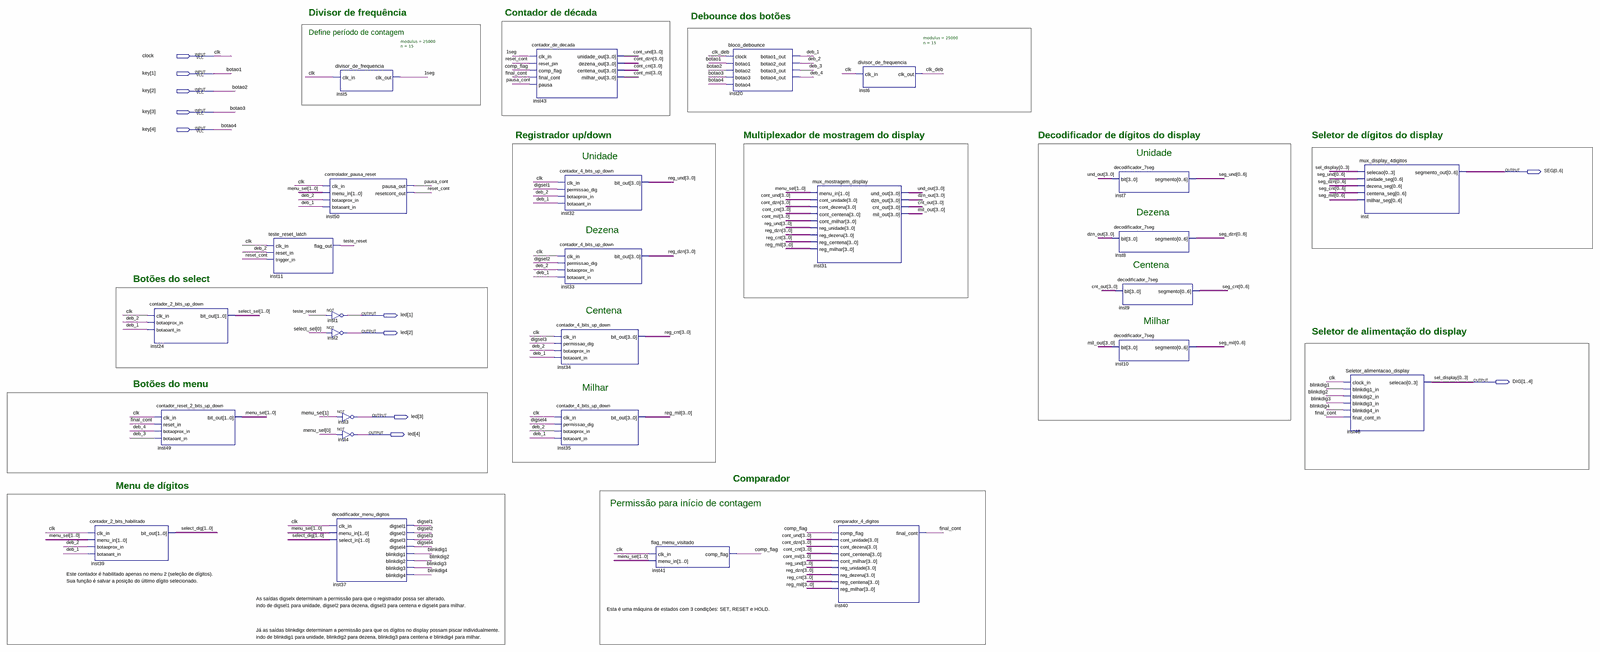
[diagram p0: schematic sheet, whole]
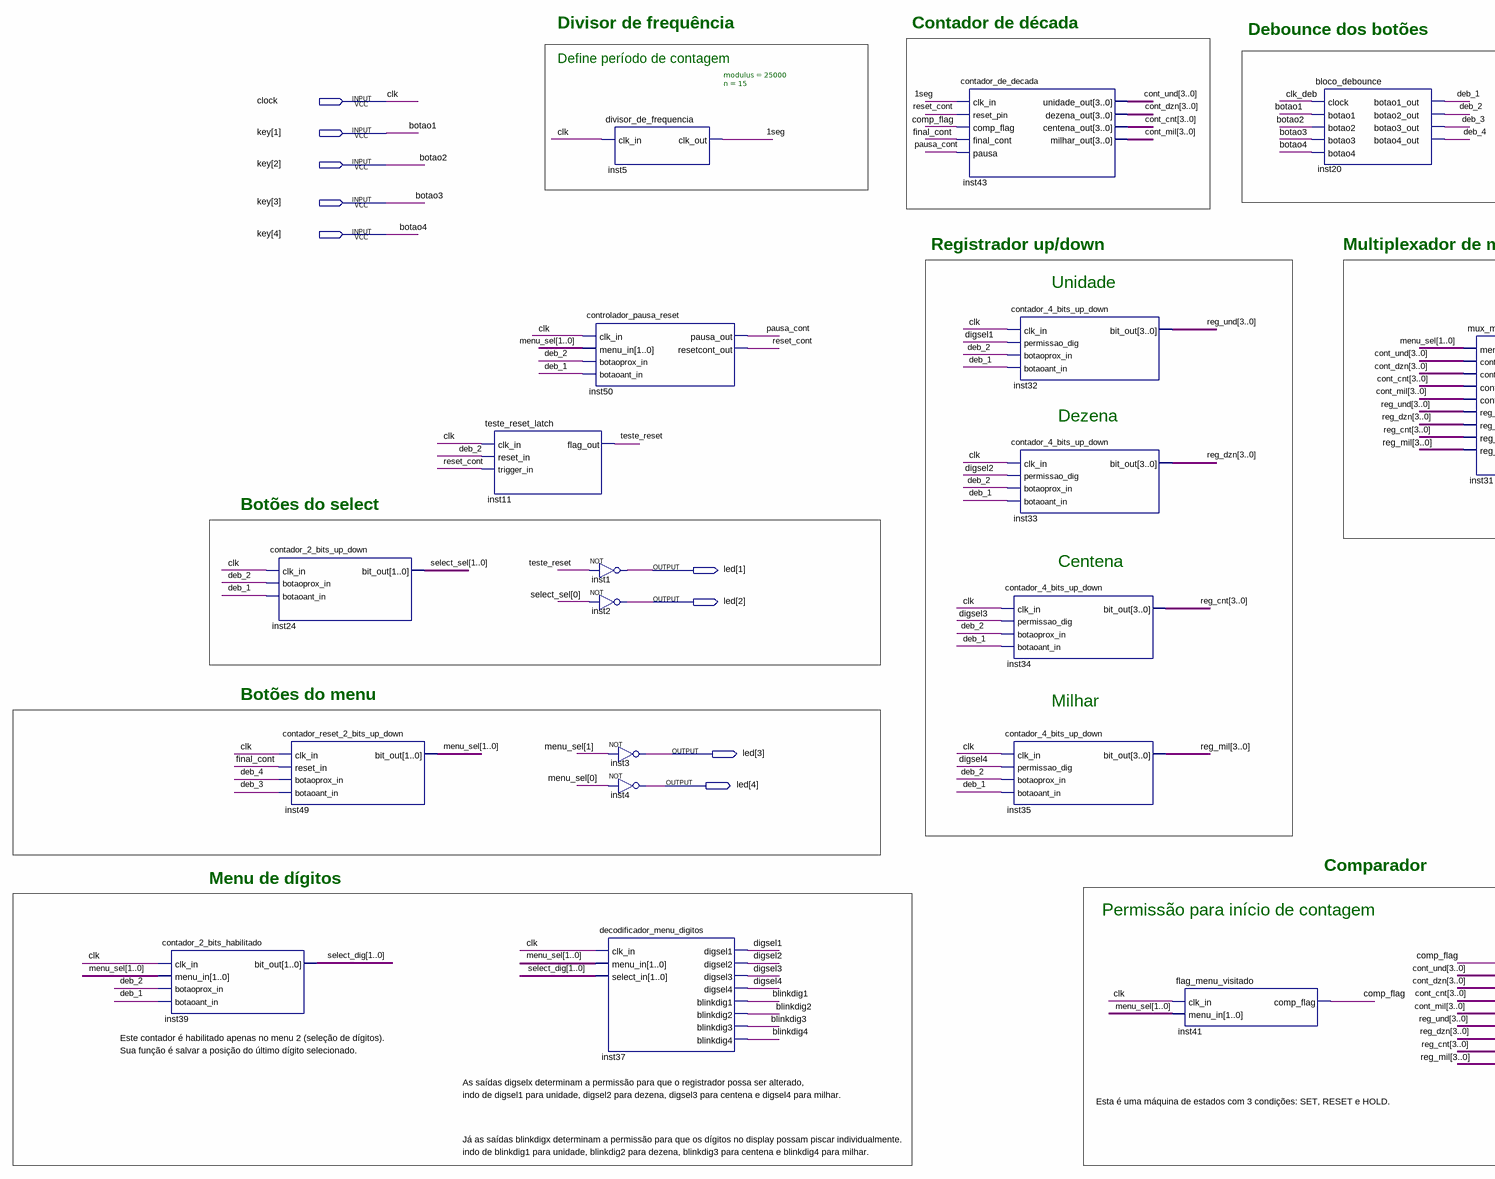
[diagram p1: schematic sheet, left part]
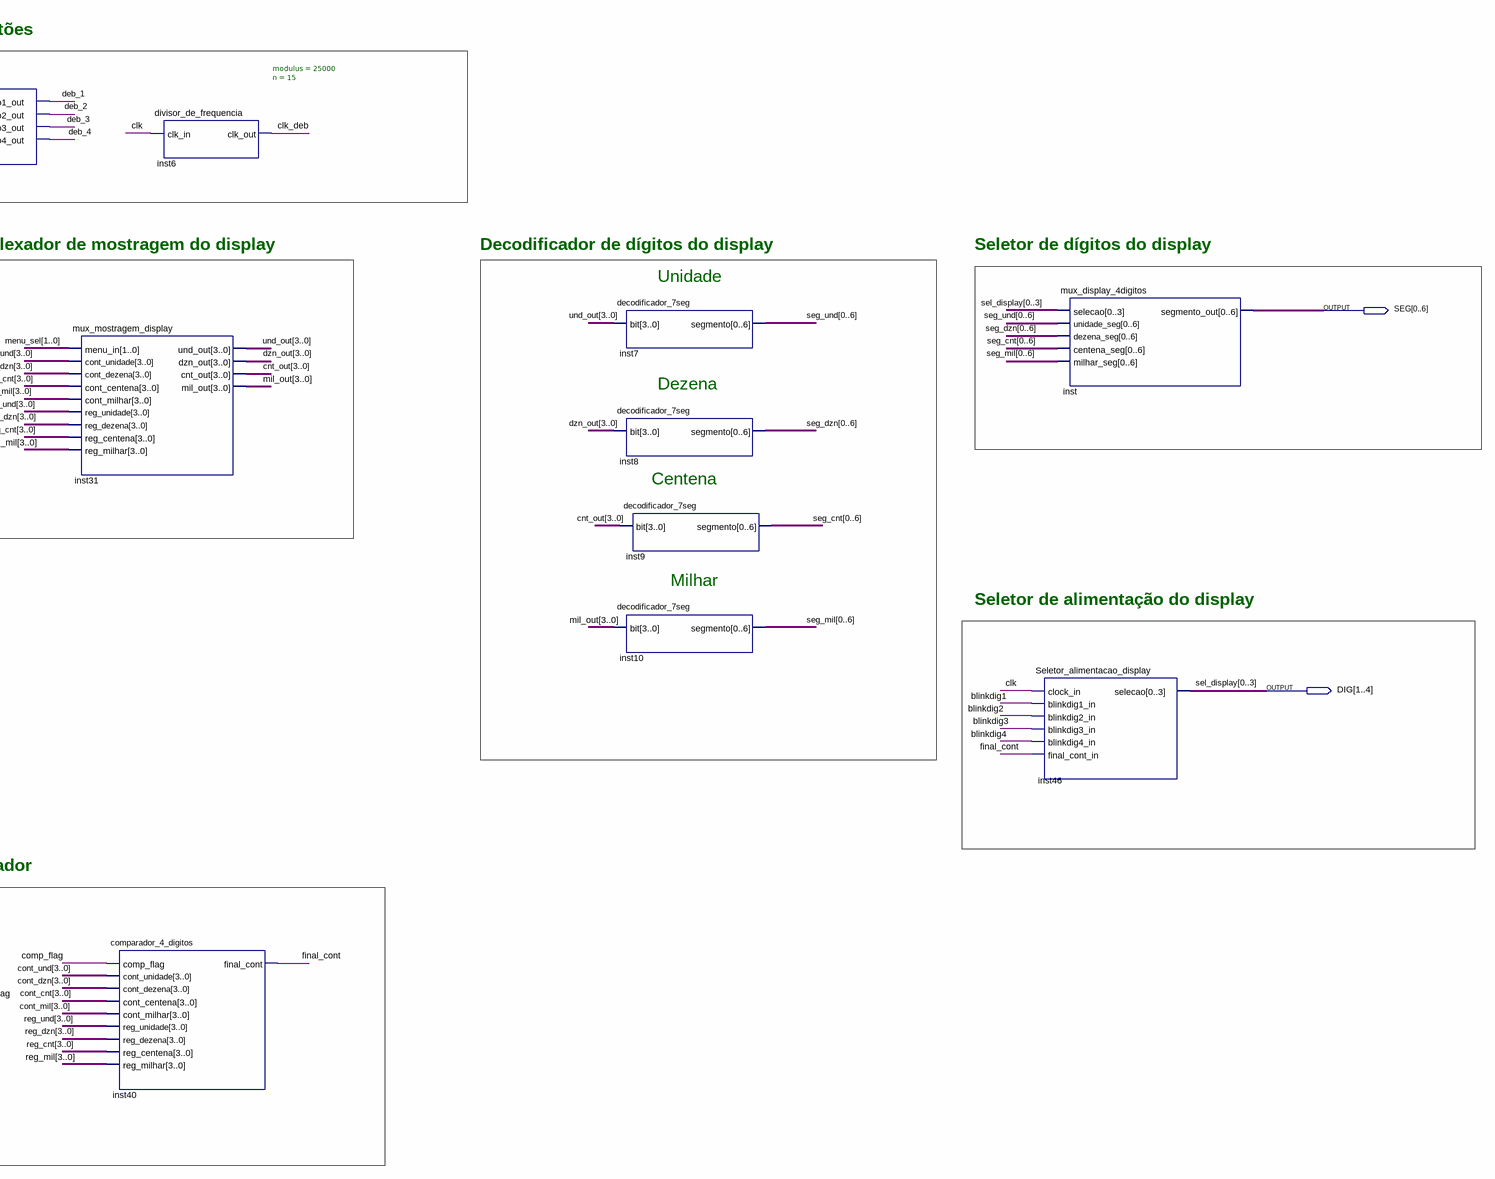
[diagram p2: schematic sheet, right part]
// Quartus schematic Projeto_02.bdf as structural Verilog: 27 symbols, 11 pins
module Projeto_02 (
  input  clock,
  input  [4:1] key,
  output [0:6] SEG,
  output [4:1] led,
  output [1:4] DIG
);

  wire \1seg , blinkdig1, blinkdig2, blinkdig3, blinkdig4, clk_deb, comp_flag, deb_1, deb_2, deb_3, deb_4,
       digsel1, digsel2, digsel3, digsel4, final_cont, pausa_cont, reset_cont, teste_reset;
  wire [1:0] menu_sel, select_dig, select_sel;
  wire [3:0] cnt_out, cont_cnt, cont_dzn, cont_mil, cont_und, dzn_out, mil_out, reg_cnt, reg_dzn, reg_mil,
       reg_und, und_out;
  wire [6:0] seg_cnt, seg_dzn, seg_mil, seg_und;

  contador_2_bits_habilitado inst39 (
    .clk_in(clock), .menu_in(menu_sel), .botaoprox_in(deb_2), .botaoant_in(deb_1), .bit_out(select_dig));
  contador_2_bits_up_down inst24 (.clk_in(clock), .botaoprox_in(deb_2), .botaoant_in(deb_1), .bit_out(select_sel));
  contador_reset_2_bits_up_down inst49 (
    .clk_in(clock), .reset_in(final_cont), .botaoprox_in(deb_4), .botaoant_in(deb_3), .bit_out(menu_sel));
  teste_reset_latch inst11 (.clk_in(clock), .reset_in(deb_2), .trigger_in(reset_cont), .flag_out(teste_reset));
  divisor_de_frequencia #(.modulus(25000), .n(15)) inst5 (.clk_in(clock), .clk_out(\1seg ));
  controlador_pausa_reset inst50 (
    .clk_in(clock), .menu_in(menu_sel), .botaoprox_in(deb_2), .botaoant_in(deb_1), .pausa_out(pausa_cont),
    .resetcont_out(reset_cont));
  not inst1 (led[1], teste_reset);
  not inst2 (led[2], select_sel[0]);
  not inst3 (led[3], menu_sel[1]);
  not inst4 (led[4], menu_sel[0]);
  decodificador_menu_digitos inst37 (
    .clk_in(clock), .menu_in(menu_sel), .select_in(select_dig), .digsel1(digsel1), .digsel2(digsel2),
    .digsel3(digsel3), .digsel4(digsel4), .blinkdig1(blinkdig1), .blinkdig2(blinkdig2),
    .blinkdig3(blinkdig3), .blinkdig4(blinkdig4));
  contador_de_decada inst43 (
    .clk_in(\1seg ), .reset_pin(reset_cont), .comp_flag(comp_flag), .final_cont(final_cont),
    .pausa(pausa_cont), .unidade_out(cont_und), .dezena_out(cont_dzn), .centena_out(cont_cnt),
    .milhar_out(cont_mil));
  contador_4_bits_up_down inst32 (
    .clk_in(clock), .permissao_dig(digsel1), .botaoprox_in(deb_2), .botaoant_in(deb_1), .bit_out(reg_und));
  contador_4_bits_up_down inst33 (
    .clk_in(clock), .permissao_dig(digsel2), .botaoprox_in(deb_2), .botaoant_in(deb_1), .bit_out(reg_dzn));
  contador_4_bits_up_down inst34 (
    .clk_in(clock), .permissao_dig(digsel3), .botaoprox_in(deb_2), .botaoant_in(deb_1), .bit_out(reg_cnt));
  contador_4_bits_up_down inst35 (
    .clk_in(clock), .permissao_dig(digsel4), .botaoprox_in(deb_2), .botaoant_in(deb_1), .bit_out(reg_mil));
  flag_menu_visitado inst41 (.clk_in(clock), .menu_in(menu_sel), .comp_flag(comp_flag));
  bloco_debounce inst20 (
    .clock(clk_deb), .botao1(key[1]), .botao2(key[2]), .botao3(key[3]), .botao4(key[4]), .botao1_out(deb_1),
    .botao2_out(deb_2), .botao3_out(deb_3), .botao4_out(deb_4));
  mux_mostragem_display inst31 (
    .menu_in(menu_sel), .cont_unidade(cont_und), .cont_dezena(cont_dzn), .cont_centena(cont_cnt),
    .cont_milhar(cont_mil), .reg_unidade(reg_und), .reg_dezena(reg_dzn), .reg_centena(reg_cnt),
    .reg_milhar(reg_mil), .und_out(und_out), .dzn_out(dzn_out), .cnt_out(cnt_out), .mil_out(mil_out));
  comparador_4_digitos inst40 (
    .comp_flag(comp_flag), .cont_unidade(cont_und), .cont_dezena(cont_dzn), .cont_centena(cont_cnt),
    .cont_milhar(cont_mil), .reg_unidade(reg_und), .reg_dezena(reg_dzn), .reg_centena(reg_cnt),
    .reg_milhar(reg_mil), .final_cont(final_cont));
  divisor_de_frequencia #(.modulus(25000), .n(15)) inst6 (.clk_in(clock), .clk_out(clk_deb));
  decodificador_7seg inst7 (
    .\bit (und_out),
    .segmento({seg_und[0], seg_und[1], seg_und[2], seg_und[3], seg_und[4], seg_und[5], seg_und[6]}));
  decodificador_7seg inst8 (
    .\bit (dzn_out),
    .segmento({seg_dzn[0], seg_dzn[1], seg_dzn[2], seg_dzn[3], seg_dzn[4], seg_dzn[5], seg_dzn[6]}));
  decodificador_7seg inst9 (
    .\bit (cnt_out),
    .segmento({seg_cnt[0], seg_cnt[1], seg_cnt[2], seg_cnt[3], seg_cnt[4], seg_cnt[5], seg_cnt[6]}));
  decodificador_7seg inst10 (
    .\bit (mil_out),
    .segmento({seg_mil[0], seg_mil[1], seg_mil[2], seg_mil[3], seg_mil[4], seg_mil[5], seg_mil[6]}));
  Seletor_alimentacao_display inst46 (
    .clock_in(clock), .blinkdig1_in(blinkdig1), .blinkdig2_in(blinkdig2), .blinkdig3_in(blinkdig3),
    .blinkdig4_in(blinkdig4), .final_cont_in(final_cont), .selecao(DIG));
  mux_display_4digitos inst (
    .selecao(DIG),
    .unidade_seg({seg_und[0], seg_und[1], seg_und[2], seg_und[3], seg_und[4], seg_und[5], seg_und[6]}),
    .dezena_seg({seg_dzn[0], seg_dzn[1], seg_dzn[2], seg_dzn[3], seg_dzn[4], seg_dzn[5], seg_dzn[6]}),
    .centena_seg({seg_cnt[0], seg_cnt[1], seg_cnt[2], seg_cnt[3], seg_cnt[4], seg_cnt[5], seg_cnt[6]}),
    .milhar_seg({seg_mil[0], seg_mil[1], seg_mil[2], seg_mil[3], seg_mil[4], seg_mil[5], seg_mil[6]}),
    .segmento_out(SEG));

  // Other names for the same wires on the sheet: botao1 = key[1]; botao2 = key[2]; botao3 = key[3]; botao4 = key[4];
  //   clk = clock; sel_display[3:0] = {DIG[4], DIG[3], DIG[2], DIG[1]}

  // Notes on the sheet:
  //   Divisor de frequência
  //   Contador de década
  //   Debounce dos botões
  //   Define período de contagem
  //   Registrador up/down
  //   Multiplexador de mostragem do display
  //   Decodificador de dígitos do display
  //   Seletor de dígitos do display
  //   Unidade
  //   Unidade
  //   Dezena
  //   Dezena
  //   Centena
  //   Botões do select
  //   Centena
  //   Milhar
  //   Seletor de alimentação do display
  //   Botões do menu
  //   Milhar
  //   Comparador
  //   Menu de dígitos
  //   Permissão para início de contagem
  //   Este contador é habilitado apenas no menu 2 (seleção de dígitos).
  //   Sua função é salvar a posição do último dígito selecionado.
  //   As saídas digselx determinam a permissão para que o registrador possa ser alterado,
  //   indo de digsel1 para unidade, digsel2 para dezena, digsel3 para centena e digsel4 para milhar.
  //   Esta é uma máquina de estados com 3 condições: SET, RESET e HOLD.
  //   Já as saídas blinkdigx determinam a permissão para que os dígitos no display possam piscar individualmente.
  //   indo de blinkdig1 para unidade, blinkdig2 para dezena, blinkdig3 para centena e blinkdig4 para milhar.
endmodule
